# EAGLE design untitled - 5 (EAGLE 7.5.0)
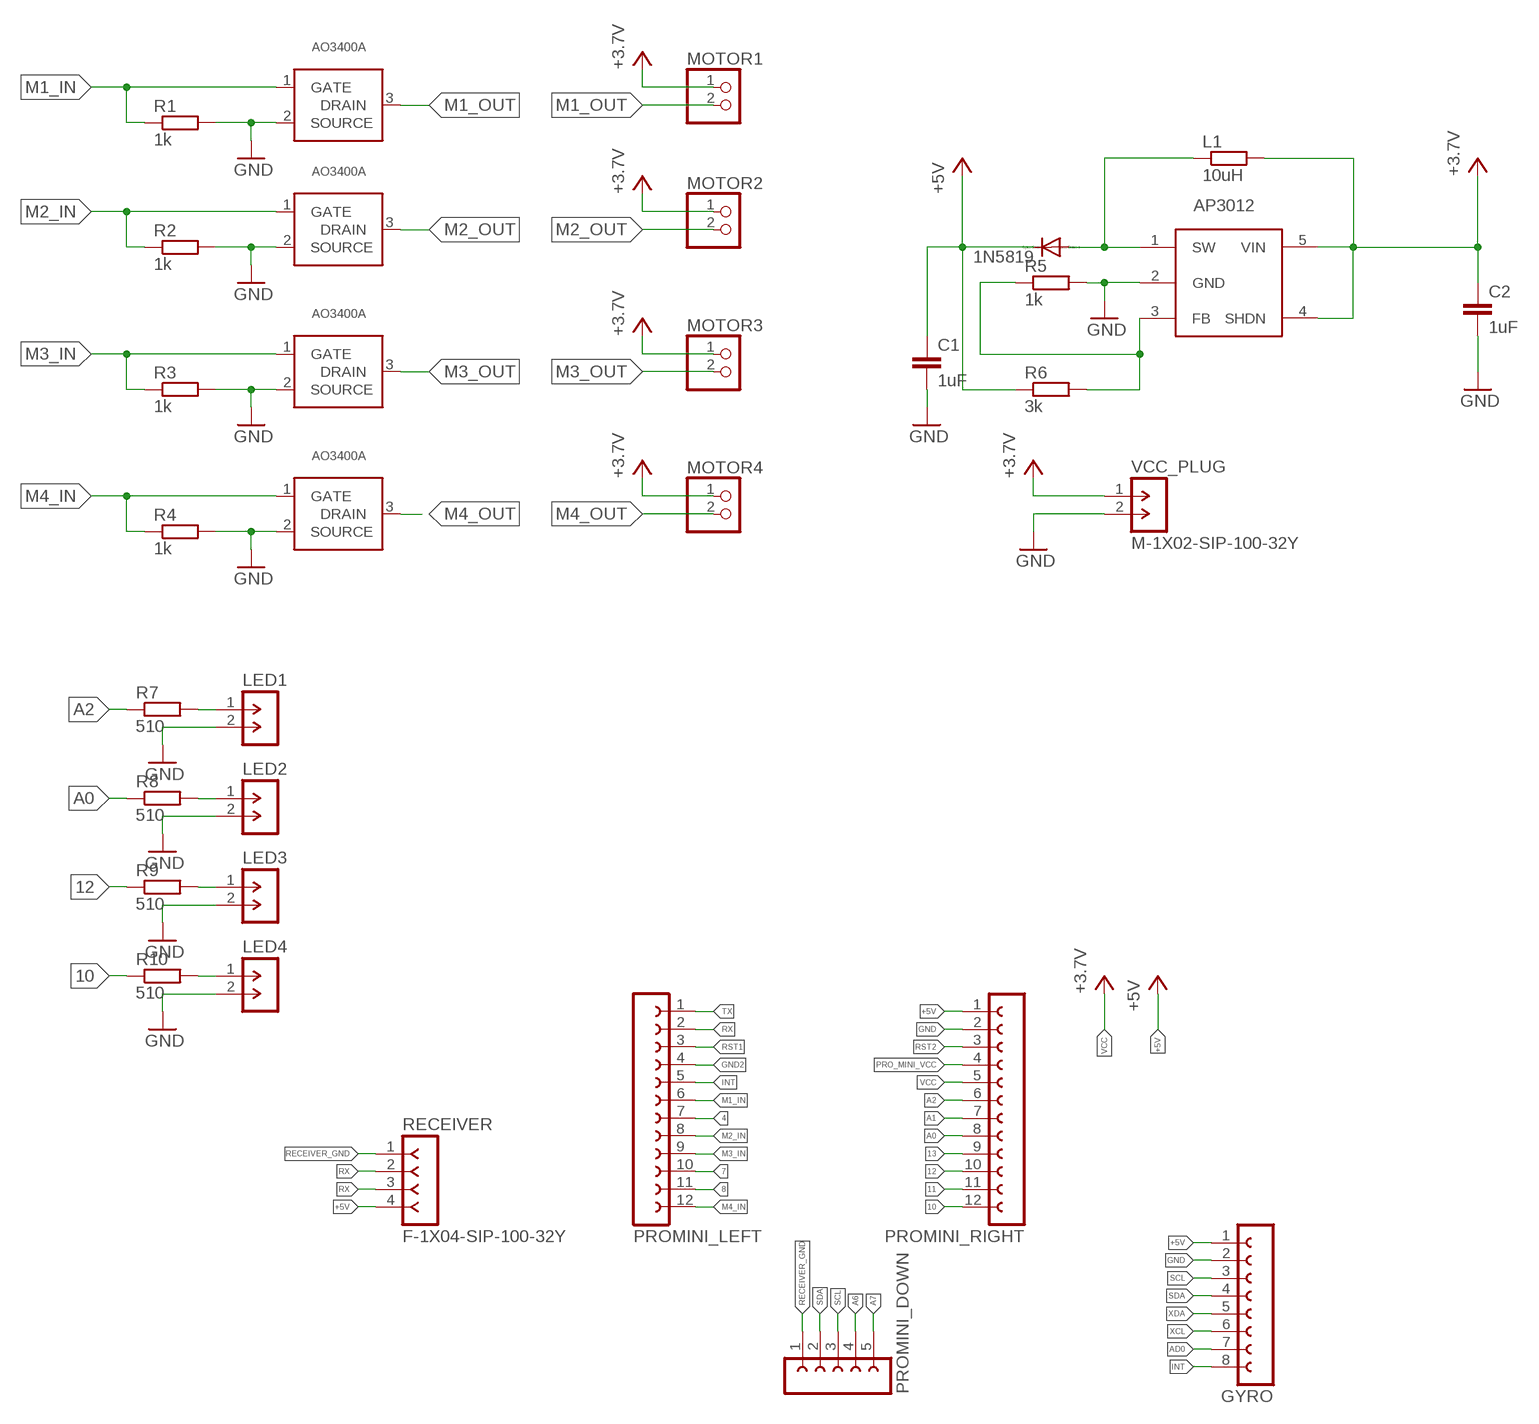
[diagram p0: schematic, sheet 1]

## Parts
1N5819  DIODE-DO214AC  [DO214AC]
C1  1uF  C-EUC1206  [C1206]
C2  1uF  C-EUC1206  [C1206]
GYRO  FE08-1  [FE08]
L1  10uH  R-EU_R0805  [R0805]
LED1  M-1X02-SIP-100-32Y  [SIP-100-02-32Y]
LED2  M-1X02-SIP-100-32Y  [SIP-100-02-32Y]
LED3  M-1X02-SIP-100-32Y  [SIP-100-02-32Y]
LED4  M-1X02-SIP-100-32Y  [SIP-100-02-32Y]
M1_DRV  AO3400A  [SOT-23]
M2_DRV  AO3400A  [SOT-23]
M3_DRV  AO3400A  [SOT-23]
M4_DRV  AO3400A  [SOT-23]
MOTOR1  PINHD-1X2  [1X02]
MOTOR2  PINHD-1X2  [1X02]
MOTOR3  PINHD-1X2  [1X02]
MOTOR4  PINHD-1X2  [1X02]
PROMINI_DOWN  FE05-1  [FE05-1]
PROMINI_LEFT  FE12-1  [FE12]
PROMINI_RIGHT  FE12-1  [FE12]
R1  1k  R-EU_R1206  [R1206]
R2  1k  R-EU_R1206  [R1206]
R3  1k  R-EU_R1206  [R1206]
R4  1k  R-EU_R1206  [R1206]
R5  1k  R-EU_R1206  [R1206]
R6  3k  R-EU_R1206  [R1206]
R7  510  R-EU_R0805  [R0805]
R8  510  R-EU_R0805  [R0805]
R9  510  R-EU_R0805  [R0805]
R10  510  R-EU_R0805  [R0805]
RECEIVER  F-1X04-SIP-100-32Y  [SIP-100-04-32Y]
U$5  AP3012  [SOT-23-5]
VCC_PLUG  M-1X02-SIP-100-32Y  [SIP-100-02-32Y]

## Nets
4: PROMINI_LEFT.7
7: PROMINI_LEFT.10
8: PROMINI_LEFT.11
10: PROMINI_RIGHT.12 R10.1
11: PROMINI_RIGHT.11
12: PROMINI_RIGHT.10 R9.1
13: PROMINI_RIGHT.9
+5V: 1N5819.C C1.1 GYRO.1 PROMINI_RIGHT.1 R6.1 RECEIVER.4
A0: PROMINI_RIGHT.8 R8.1
A1: PROMINI_RIGHT.7
A2: PROMINI_RIGHT.6 R7.1
A6: PROMINI_DOWN.4
A7: PROMINI_DOWN.5
AD0: GYRO.7
GND: C1.2 C2.2 GYRO.2 LED1.2 LED2.2 LED3.2 LED4.2 M1_DRV.2(SOURCE) M2_DRV.2(SOURCE) M3_DRV.2(SOURCE) M4_DRV.2(SOURCE) PROMINI_RIGHT.2 R1.2 R2.2 R3.2 R4.2 R5.2 U$5.2(GND) VCC_PLUG.2
GND2: PROMINI_LEFT.4
INT: GYRO.8 PROMINI_LEFT.5
M1_IN: M1_DRV.1(GATE) PROMINI_LEFT.6 R1.1
M1_OUT: M1_DRV.3(DRAIN) MOTOR1.2
M2_IN: M2_DRV.1(GATE) PROMINI_LEFT.8 R2.1
M2_OUT: M2_DRV.3(DRAIN) MOTOR2.2
M3_IN: M3_DRV.1(GATE) PROMINI_LEFT.9 R3.1
M3_OUT: M3_DRV.3(DRAIN) MOTOR3.2
M4_IN: M4_DRV.1(GATE) PROMINI_LEFT.12 R4.1
M4_OUT: M4_DRV.3(DRAIN) MOTOR4.2
N$1: LED4.1 R10.2
N$2: 1N5819.A L1.1 U$5.1(SW)
N$3: R5.1 R6.2 U$5.3(FB)
N$4: LED3.1 R9.2
N$5: LED2.1 R8.2
N$6: LED1.1 R7.2
PRO_MINI_VCC: PROMINI_RIGHT.4
RECEIVER_GND: PROMINI_DOWN.1 RECEIVER.1
RST1: PROMINI_LEFT.3
RST2: PROMINI_RIGHT.3
RX: PROMINI_LEFT.2 RECEIVER.2 RECEIVER.3
SCL: GYRO.3 PROMINI_DOWN.3
SDA: GYRO.4 PROMINI_DOWN.2
TX: PROMINI_LEFT.1
VCC: C2.1 L1.2 MOTOR1.1 MOTOR2.1 MOTOR3.1 MOTOR4.1 PROMINI_RIGHT.5 U$5.4(SHDN) U$5.5(VIN) VCC_PLUG.1 ; supply symbol labelled +3.7V
XCL: GYRO.6
XDA: GYRO.5

## Library data of the parts
1N5819 = diode:DIODE-: DIODE
C1 C2 = resistor:C-EU: CAPACITOR, European symbol
GYRO = con-lsta:FE08-1: FEMALE HEADER; OC_FARNELL: unknown; OC_NEWARK: unknown
L1 R1-R10 = resistor:R-EU_: RESISTOR, European symbol
LED1-LED4 VCC_PLUG = con-headers-jp:M-1X02-: MALE HEADER
M1_DRV M2_DRV M3_DRV M4_DRV = smd-footprints:AO3400A
MOTOR1-MOTOR4 = pinhead:PINHD-1X2: PIN HEADER
PROMINI_DOWN = con-lsta:FE05-1: FEMALE HEADER; OC_FARNELL: unknown; OC_NEWARK: unknown
PROMINI_LEFT PROMINI_RIGHT = con-lsta:FE12-1: FEMALE HEADER; OC_FARNELL: unknown; OC_NEWARK: unknown
RECEIVER = con-headers-jp:F-1X04-: FEMALE HEADER
U$5 = smd-footprints:AP3012

## Board
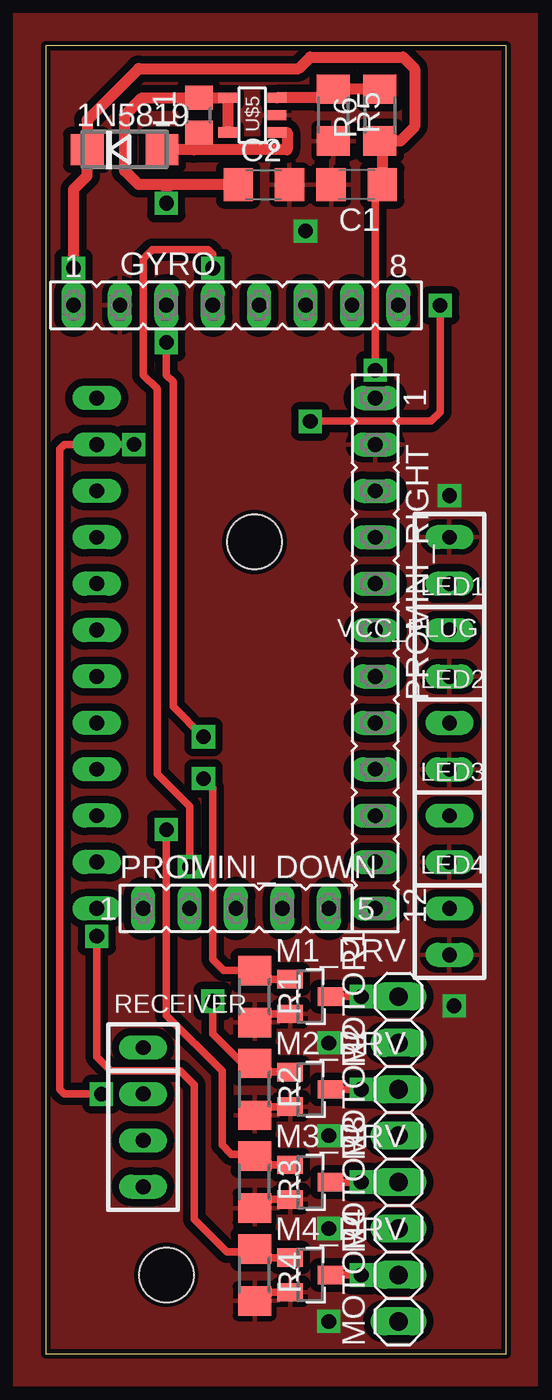
[diagram p1: board, top side]
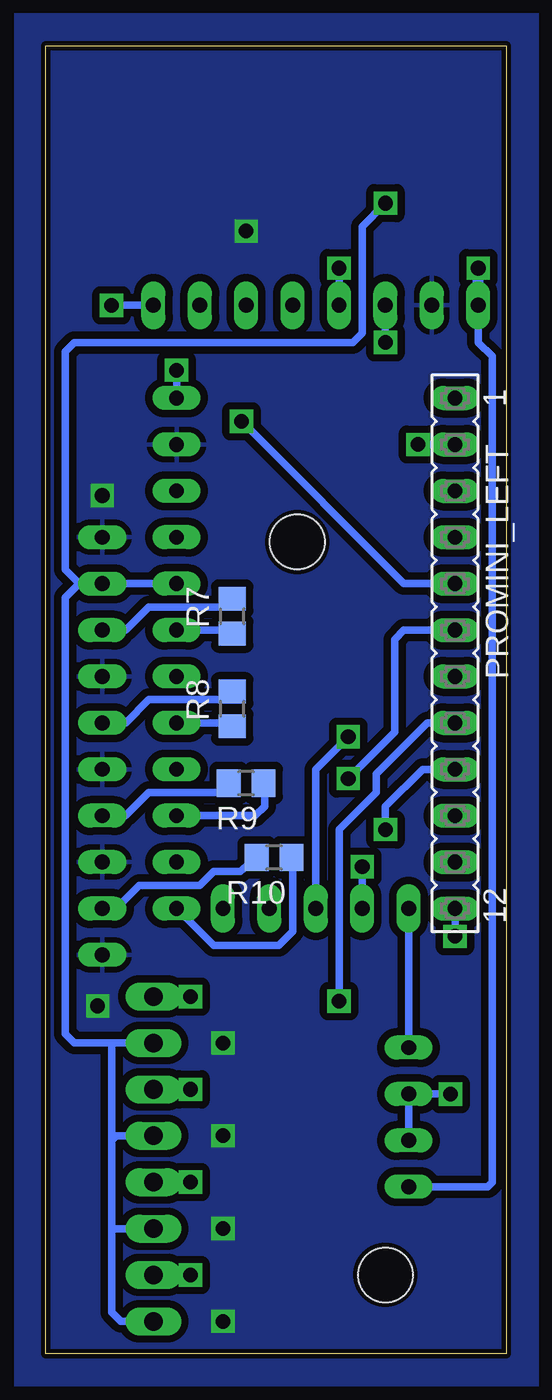
[diagram p2: board, bottom side, seen from below]

Size 25.2 x 71.62 mm. Coordinates in mm from the lower left corner, seen from the top.
Outline: 0,0 25.2,0 25.2,71.62 0,71.62 0,0
Copper layers (1*16): Top 0.035mm / dielectric 1.5mm / Bottom 0.035mm
Design rules "default 16mils": minimum track width 10mil, minimum drill 24mil, track to track 16mil, track to pad 16mil, pad to pad 16mil, via to via 16mil, smd to smd 10mil, copper to edge 10mil, drill to drill 10mil, minimum pad ring 10mil, minimum via ring 8mil, stop-mask expansion 4mil, vias tented up to drill 0mil, thermal gap 12mil
Holes 3 mm at 11.43,44.45 6.6,4.32

### Footprints (pad centres in the part's own frame; a part is rotated, then mirrored left to right if it is on the bottom)
DO214AC = smd 1.8 x 1.7: A 2.05,0; C -2.05,0
C1206 = smd 1.6 x 1.8: 1 -1.4,0; 2 1.4,0
FE08 = drill 0.813 long: 1 -8.89,0; 2 -6.35,0; 3 -3.81,0; 4 -1.27,0; 5 1.27,0; 6 3.81,0; 7 6.35,0; 8 8.89,0
R0805 = smd 1.3 x 1.5: 1 -0.95,0; 2 0.95,0
SIP-100-02-32Y = drill 0.813 long: 1 -1.27,0; 2 1.27,0
SOT-23 = smd 1 x 1.4: 1 -0.95,-1.1; 2 0.95,-1.1; 3 0,1.1
1X02 = drill 1.016 long: 1 -1.27,0; 2 1.27,0
FE05-1 = drill 0.813 long: 1 -5.08,0; 2 -2.54,0; 3 0,0; 4 2.54,0; 5 5.08,0
FE12 = drill 0.813 long: 1 -13.97,0; 2 -11.43,0; 3 -8.89,0; 4 -6.35,0; 5 -3.81,0; 6 -1.27,0; 7 1.27,0; 8 3.81,0; 9 6.35,0; 10 8.89,0; 11 11.43,0; 12 13.97,0
R1206 = smd 1.6 x 1.803: 1 -1.422,0; 2 1.422,0
SIP-100-04-32Y = drill 0.813 long: 1 -3.81,0; 2 -1.27,0; 3 1.27,0; 4 3.81,0
SOT-23-5 = smd 1 x 0.55: 1 -1.35,0.95; 2 -1.35,0; 3 -1.35,-0.95; 4 1.35,-0.95; 5 1.35,0.95

### Placement (x,y rotation side)
1N5819  4.32,65.91 0 top
C1  17.02,64.01 180 top
C2  11.94,64.01 0 top
GYRO  10.41,57.4 0 top
L1  8.38,67.82 90 top
LED1  22.1,38.35 270 top
LED2  22.1,33.27 270 top
LED3  22.1,28.19 270 top
LED4  22.1,23.11 270 top
M1_DRV  14.48,19.56 270 top
M2_DRV  14.48,14.48 270 top
M3_DRV  14.48,9.4 270 top
M4_DRV  14.48,4.32 270 top
MOTOR1  19.3,18.29 90 top
MOTOR2  19.3,13.21 90 top
MOTOR3  19.3,8.13 90 top
MOTOR4  19.3,3.05 90 top
PROMINI_DOWN  10.41,24.38 0 top
PROMINI_LEFT  2.79,38.35 270 bottom
PROMINI_RIGHT  18.03,38.35 270 top
R1  11.43,19.56 270 top
R2  11.43,14.48 270 top
R3  11.43,9.4 270 top
R4  11.43,4.32 270 top
R5  15.75,67.82 270 top
R6  18.29,67.82 90 top
R7  14.99,40.39 90 bottom
R8  14.99,35.31 90 bottom
R9  14.22,31.24 180 bottom
R10  12.7,27.18 180 bottom
RECEIVER  5.33,12.95 270 top
U$5  11.3,67.82 180 top
VCC_PLUG  22.1,43.43 90 top

### Tracks (layer width: path | path; a pad name or v marks a point on that pad's centre or on a via)
10
  Bottom 0.406: PROMINI_RIGHT.12 16,22.35 12.45,22.35 11.68,23.11 11.68,27.11 R10.1
12
  Bottom 0.406: PROMINI_RIGHT.10 13.72,29.46 13.21,29.97 13.21,31.18 R9.1
+5V  (via drill 0.8 pad 1.27)
  Top 0.254: 18.42,66.29 18.29,66.29 R6.1
  Top 0.406: v18.03,53.85 18.03,63.62
  Top 0.61: 18.42,66.29 C1.1 18.03,63.62 | R6.1 19.41,66.4 20.19,67.18 20.19,70.36 19.56,70.99 14.48,70.99 13.84,70.36 5.08,70.36 2.27,67.55 1N5819.C 2.27,64.5 1.52,63.75 v1.52,59.44
  Bottom 0.406: GYRO.1 1.52,55.37 0.76,54.61 0.76,9.4 1.02,9.14 RECEIVER.4 | PROMINI_RIGHT.1 v18.03,53.85
  Bottom 0.61: GYRO.1 v1.52,59.44
A0
  Bottom 0.406: PROMINI_RIGHT.8 15.17,34.54 R8.1
A2
  Bottom 0.406: PROMINI_RIGHT.6 15.17,39.62 R7.1
GND  (via drill 0.8 pad 1.27)
  Top 0.406: R1.2 12.41,18.61 M1_DRV.2 | R2.2 12.41,13.53 M2_DRV.2 | R3.2 12.41,8.45 M3_DRV.2 | R4.2 12.41,3.37 M4_DRV.2
  Top 0.61: C1.2 15.75,64.14
  other vias: 15.49,6.86 15.49,1.78 15.49,11.94 15.49,17.02 22.1,46.99 14.22,61.47 22.35,19.05
  pour Top: 0,71.63 25.15,71.63 25.15,0 0,0
  pour Bottom: 0,71.63 25.15,71.63 25.15,0 0,0
INT  (via drill 0.8 pad 1.27)
  Top 0.406: v14.48,51.05 21.08,51.05 21.59,51.56 v21.59,57.4
  Bottom 0.406: PROMINI_LEFT.5 5.59,42.16 v14.48,51.05 | GYRO.8 v21.59,57.4
M1_IN  (via drill 0.8 pad 1.27)
  Top 0.406: M1_DRV.1 12.41,20.51 R1.1 9.75,20.98 9.14,21.59 9.14,30.99 v8.64,31.5
  Bottom 0.406: PROMINI_LEFT.6 5.59,39.62 6.1,39.12 6.1,34.04 v8.64,31.5
M1_OUT  (via drill 0.8 pad 1.27)
  Top 0.406: v17.27,19.56 M1_DRV.3
  Bottom 0.406: MOTOR1.2 v17.27,19.56
M2_IN  (via drill 0.8 pad 1.27)
  Top 0.254: 10.77,15.9 R2.1
  Top 0.406: R2.1 12.41,15.43 M2_DRV.1 | v9.14,19.3 9.14,17.53 10.77,15.9
  Bottom 0.406: PROMINI_LEFT.8 4.32,34.54 7.11,31.75 7.11,30.73 9.14,28.7 v9.14,19.3
M2_OUT  (via drill 0.8 pad 1.27)
  Top 0.406: v17.27,14.48 M2_DRV.3
  Bottom 0.406: MOTOR2.2 v17.27,14.48
M3_IN  (via drill 0.8 pad 1.27)
  Top 0.254: R3.1 10.77,10.82 10.67,10.92
  Top 0.406: R3.1 12.41,10.35 M3_DRV.1 | 10.67,10.92 10.16,10.92 9.65,11.43 9.65,15.49 6.6,18.54 6.6,26.42 v6.6,28.7
  Bottom 0.406: PROMINI_LEFT.9 4.57,32 6.6,29.97 v6.6,28.7
M3_OUT  (via drill 0.8 pad 1.27)
  Top 0.406: v17.27,9.4 M3_DRV.3
  Bottom 0.406: MOTOR3.2 v17.27,9.4
M4_IN  (via drill 0.8 pad 1.27)
  Top 0.254: 10.67,5.84 11.84,5.84 R4.1
  Top 0.406: M4_DRV.1 12.41,5.27 R4.1 11.28,5.59 9.91,5.59 8.13,7.37 8.13,14.73 7.37,15.49 3.56,15.49 2.79,16.26 v2.79,22.86
  Bottom 0.406: PROMINI_LEFT.12 v2.79,22.86
M4_OUT  (via drill 0.8 pad 1.27)
  Top 0.406: v17.27,4.32 M4_DRV.3
  Bottom 0.406: MOTOR4.2 v17.27,4.32
N$1
  Bottom 0.406: R10.2 14.54,26.42 16,26.42 16.76,25.65 20.07,25.65 21.34,24.38 LED4.1
N$2
  Top 0.61: L1.1 8.13,65.91 | U$5.1 13.21,66.87 13.21,65.91 8.13,65.91 | 8.13,65.91 1N5819.A
N$3
  Top 0.61: R6.2 R5.1 15.28,68.77 U$5.3
N$4
  Bottom 0.406: LED3.1 20.83,29.46 19.56,30.73 15.43,30.73 15.43,30.99 R9.2
N$5
  Bottom 0.406: LED2.1 20.83,34.54 19.56,35.81 15.43,35.81 R8.2
N$6
  Bottom 0.406: LED1.1 20.83,39.62 19.56,40.89 15.43,40.89 R7.2
N$7
  pour Top: -1.78,73.41 26.92,73.41 26.92,-1.78 -1.78,-1.78
N$8
  pour Bottom: -1.78,-1.78 26.92,-1.78 26.92,73.41 -1.78,73.41
RECEIVER_GND
  Bottom 0.406: PROMINI_DOWN.1 RECEIVER.1
RX  (via drill 0.8 pad 1.27)
  Top 0.406: v4.83,49.78 1.02,49.78 0.76,49.53 0.76,14.48 1.02,14.22 v3.05,14.22
  Bottom 0.406: PROMINI_LEFT.2 v4.83,49.78 | v3.05,14.22 RECEIVER.2 RECEIVER.3
SCL  (via drill 0.8 pad 1.27)
  Top 0.406: v6.6,55.37 6.6,53.59 6.98,53.21 6.98,35.43 v8.64,33.78
  Bottom 0.406: GYRO.3 v6.6,55.37 | v8.64,33.78 10.41,32 PROMINI_DOWN.3
SDA  (via drill 0.8 pad 1.27)
  Top 0.406: v9.14,59.44 9.14,60.2 8.89,60.45 5.84,60.45 5.33,59.94 5.33,53.59 6.1,52.83 6.1,31.75 7.87,29.97 v7.87,26.67
  Bottom 0.406: GYRO.4 v9.14,59.44 | v7.87,26.67 PROMINI_DOWN.2
VCC  (via drill 0.8 pad 1.27)
  Top 0.61: U$5.5 U$5.4 L1.2 | L1.2 7.81,68.45 | 6.6,64.01 5.08,64.01 4.32,64.77 4.32,67.82 5.27,68.77 L1.2 | 10.67,63.88 C2.1 6.6,64.01 | 6.6,64.01 v6.6,62.99
  Bottom 0.406: v6.6,62.99 7.87,61.72 7.87,55.88 8.38,55.37 23.62,55.37 24.13,54.86 24.13,42.93 23.37,42.16 | PROMINI_RIGHT.5 VCC_PLUG.1 23.37,42.16 | 23.37,42.16 24.13,41.4 24.13,17.53 23.62,17.02 21.59,17.02 | MOTOR1.1 21.59,17.02 | 21.59,17.02 21.59,11.68 | 21.59,11.68 21.59,6.86 | 21.59,6.86 21.59,2.29 21.08,1.78 MOTOR4.1 | MOTOR3.1 21.59,6.86 | MOTOR2.1 21.34,11.94 21.59,11.68

### Text on the board
tDescription: SCL | SDA | XDA | AD0 | INT | XCL | 5V | GND | +5V | TX | RX | - | + | VCC | Quadcopter / by Sh4DoV v1.0 | GND | M1+ | M2- | M2+ | RX | 5V | M3- | M3+ | M4- | M4+